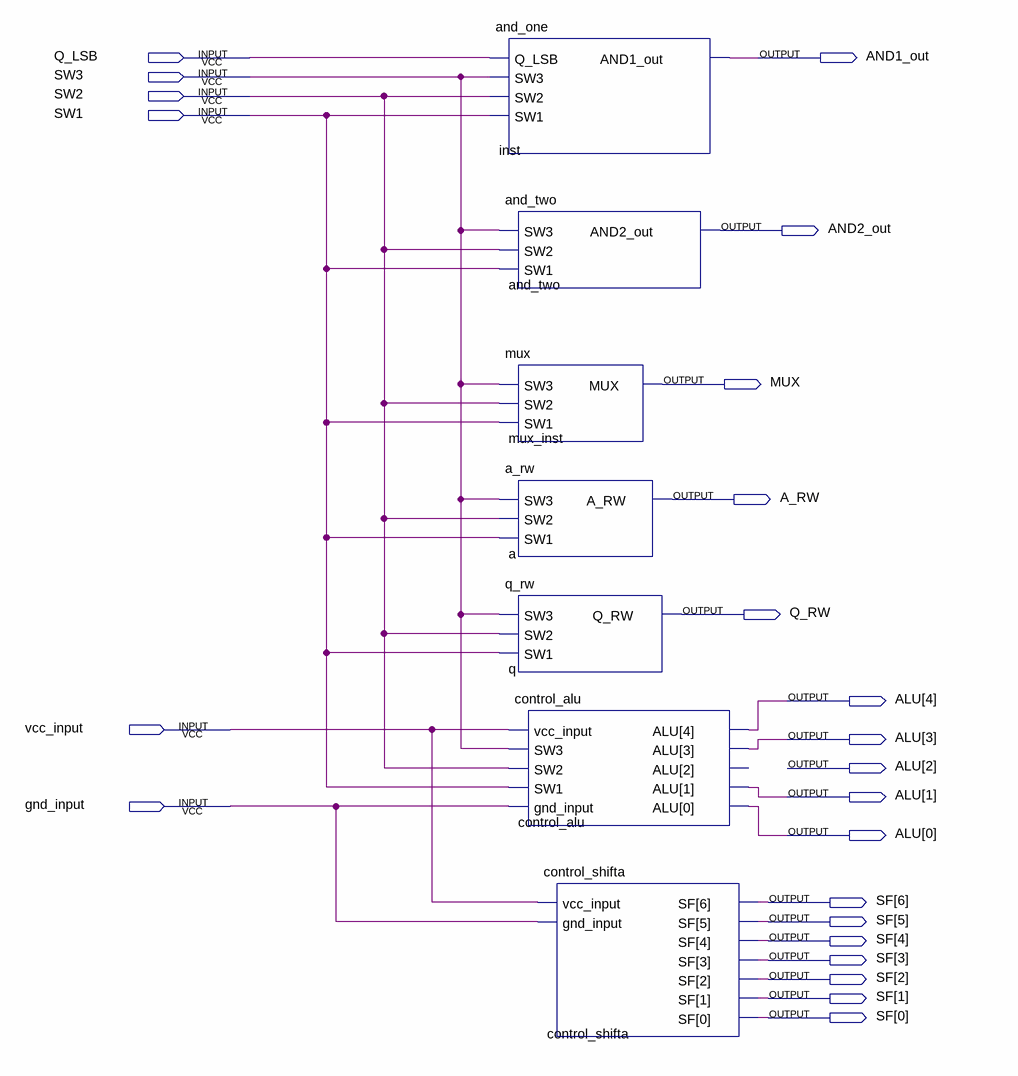
[diagram p0: schematic sheet]
// Quartus schematic out.bdf as structural Verilog: 7 symbols, 23 pins
module out (
  input  Q_LSB,
  input  SW3,
  input  SW2,
  input  SW1,
  input  vcc_input,
  input  gnd_input,
  output AND1_out,
  output AND2_out,
  output MUX,
  output A_RW,
  output Q_RW,
  output [4:0] ALU,
  output [6:0] SF
);
  wire [4:0] control_alu_alu_open;  // unused outputs

  and_one inst (.Q_LSB(Q_LSB), .SW3(SW3), .SW2(SW2), .SW1(SW1), .AND1_out(AND1_out));
  and_two and_two (.SW3(SW3), .SW2(SW2), .SW1(SW1), .AND2_out(AND2_out));
  mux mux_inst (.SW3(SW3), .SW2(SW2), .SW1(SW1), .MUX(MUX));
  a_rw a (.SW3(SW3), .SW2(SW2), .SW1(SW1), .A_RW(A_RW));
  q_rw q (.SW3(SW3), .SW2(SW2), .SW1(SW1), .Q_RW(Q_RW));
  control_alu control_alu (
    .vcc_input(vcc_input), .SW3(SW3), .SW2(SW2), .SW1(SW1), .gnd_input(gnd_input),
    .ALU({ALU[4:3], control_alu_alu_open[2], ALU[1:0]}));
  control_shifta control_shifta (.vcc_input(vcc_input), .gnd_input(gnd_input), .SF(SF));
endmodule
